# EAGLE design NeopixelExtension (EAGLE 7.2.0)
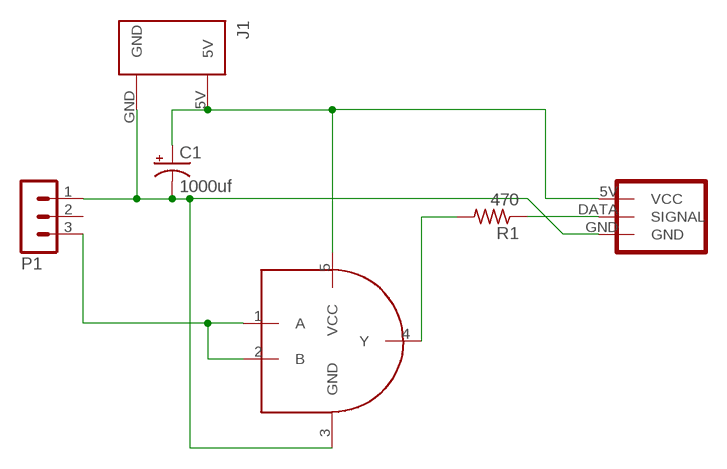
[diagram p0: schematic, sheet 1]

## Parts
C1  1000uf  CPOL-USE5-10.5  [E5-10,5]
J1  POWER  [POWER]
P1  MA03-1  [MA03-1]
R1  470  R-US_R1206  [R1206]
U1  74AHCT1G08  [SOT25]
U$2  NEOPIXEL1  [NEODIRECTSOLDERORMA03-1]

## Nets
GND: C1.- J1.GND P1.1 U1.3(GND) U$2.GND
N$1: R1.1 U$2.DATA(SIGNAL)
N$2: P1.3 U1.1(A) U1.2(B)
N$4: R1.2 U1.4(Y)
VCC: C1.+ J1.5V U1.5(VCC) U$2.5V(VCC)
Unconnected: P1.2

## Library data of the parts
C1 = adafruit:CPOL-US: POLARIZED CAPACITOR, American symbol
J1 = Molex-39543-0002:POWER
P1 = con-lstb-modified:MA03-1: PIN HEADER; OC_FARNELL: unknown; OC_NEWARK: unknown
R1 = resistor:R-US_: RESISTOR, American symbol
U1 = SOT25:74AHCT1G08
U$2 = NeopixelConnector:NEOPIXEL1

## Board
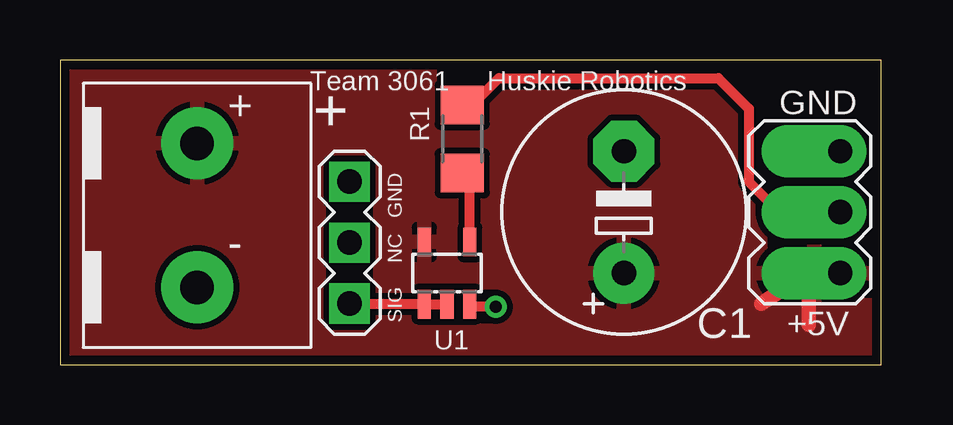
[diagram p1: board, top side]
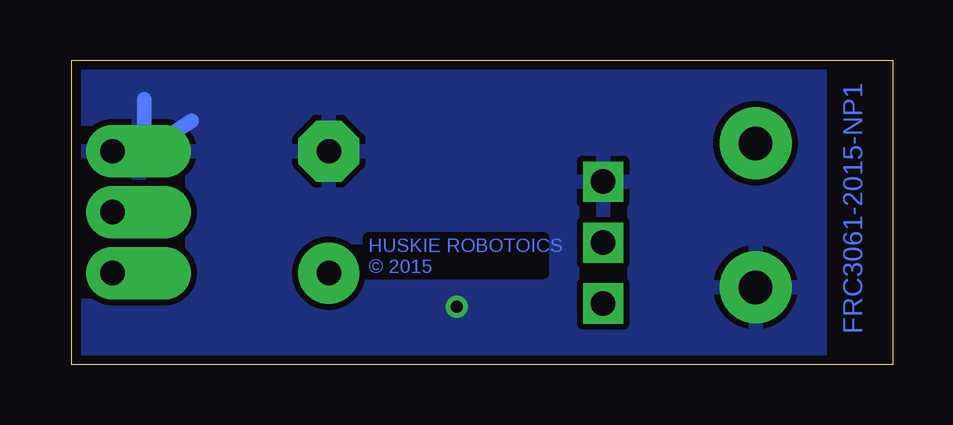
[diagram p2: board, bottom side, seen from below]

Size 34.21 x 12.69 mm. Coordinates in mm from the lower left corner, seen from the top.
Outline: 0,0 34.21,0 34.21,12.69 0,12.69 0,0
Copper layers (1*16): Top 0.035mm / dielectric 1.5mm / Bottom 0.035mm
Design rules "midwestpcb": minimum track width 3mil, minimum drill 6mil, track to track 3mil, track to pad 3mil, pad to pad 3mil, via to via 3mil, smd to smd 3mil, copper to edge 15mil, drill to drill 8mil, minimum pad ring 10mil, minimum via ring 8mil, stop-mask expansion 3mil, vias tented up to drill 0mil, thermal gap 10mil

### Footprints (pad centres in the part's own frame; a part is rotated, then mirrored left to right if it is on the bottom)
E5-10,5 = drill 1.016 pad 2.54: + -2.54,0 | drill 1.016 pad 2.54 octagon: - 2.54,0
POWER = drill 1.4 pad 3: 5V 0,3.5; GND 0,-2.5
MA03-1 = drill 1.016 pad 1.676 square: 1 -2.54,0; 2 0,0; 3 2.54,0
R1206 = smd 1.6 x 1.803: 1 -1.422,0; 2 1.422,0
SOT25 = smd 0.55 x 1.2: 1 -0.95,-1.3; 2 0,-1.3; 3 0.95,-1.3; 4 0.95,1.3; 5 -0.95,1.3
NEODIRECTSOLDERORMA03-1 = drill 1.016 pad 2.184 offset: 5V 2.54,2.54; DATA 0,2.54; GND -2.54,2.54

### Placement (x,y rotation side)
C1  23.5,6.35 90 top
J1  5.71,5.71 0 top
P1  Input  [MA03-1]  12.06,5.08 270 top
R1  16.76,9.4 270 top
U1  16.13,3.81 0 top
U$2  29.97,6.35 270 top

### Tracks (layer width: path | path; a pad name or v marks a point on that pad's centre or on a via)
GND  (via drill 0.5)
  Top 0.406: v18.16,2.41 17.18,2.41 U1.3
  Bottom 0.61: 31.19,11.05 31.19,8.88 29.21,10.16
  pour Bottom (isolate 0.254): 34.29,12.7 34.29,0 3.05,0 3.05,12.7
N$1
  Top 0.406: R1.1 16.76,10.41 18.29,11.94 27.43,11.94 28.7,10.67 28.7,7.62 29.97,6.35 U$2.DATA
N$2
  Top 0.406: P1.3 15.18,2.54 U1.1 U1.2
N$4
  Top 0.406: U1.4 17.08,7.81 R1.2
VCC
  Top 0.61: 29.21,2.54 31.19,3.87 31.19,1.65
  pour Top (isolate 0.254): 0,0 34.29,0 34.29,12.7 0,12.7

### Text on the board
Bottom: HUSKIE ROBOTOICS / © 2015 | FRC3061-2015-NP1
tPlace: Team 3061 | Huskie Robotics
tNames: + | GND | NC | SIG